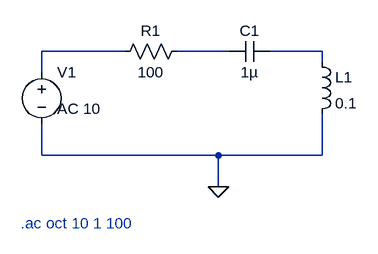
[diagram p0: schematic rlc.asc]
rlc.asc, the LTspice schematic file:
Version 4.1
SHEET 1 880 680
WIRE 80 112 -48 112
WIRE 240 112 160 112
WIRE 384 112 304 112
WIRE 384 128 384 112
WIRE -48 144 -48 112
WIRE -48 272 -48 224
WIRE 224 272 -48 272
WIRE 384 272 384 208
WIRE 384 272 224 272
WIRE 224 320 224 272
FLAG 224 320 0
SYMBOL voltage -48 128 R0
WINDOW 3 24 44 Left 2
WINDOW 123 24 72 Left 2
WINDOW 39 0 0 Left 0
SYMATTR InstName V1
SYMATTR Value ""
SYMATTR Value2 AC 10
SYMBOL res 176 96 R90
WINDOW 0 0 56 VBottom 2
WINDOW 3 32 56 VTop 2
SYMATTR InstName R1
SYMATTR Value 100
SYMBOL cap 240 96 M90
WINDOW 0 0 32 VBottom 2
WINDOW 3 32 32 VTop 2
SYMATTR InstName C1
SYMATTR Value 1µ
SYMBOL ind 368 112 R0
SYMATTR InstName L1
SYMATTR Value 0.1
TEXT -80 376 Left 2 ;.ac oct 10 1 100

The netlist it stands for:
* rlc.asc
V1 N001 0 AC 10
R1 N002 N001 100
C1 N002 N003 1µ
L1 N003 0 0.1
* .ac oct 10 1 100
.backanno
.end